# Altium schematic sheet WX0.012.296DL(3).SchDoc
size A3; PageSetup: Record=PageOptions|CenterHorizontal=True|CenterVertical=True|PrintScale=0.73|XCorrection=1.00|YCorrection=1.00|PrintKind=1|BorderSize=5000000|LeftOffset=0|BottomOffset=0|Orientation=2|PaperLength=1000|PaperWidth=1000|Scale=100|PaperSource=7|PrintQuality=-3|MediaType=1|DitherType=10|PrintScaleMode=1|PaperKind=A4 (210 x 297 毫米)|PaperIndex=9
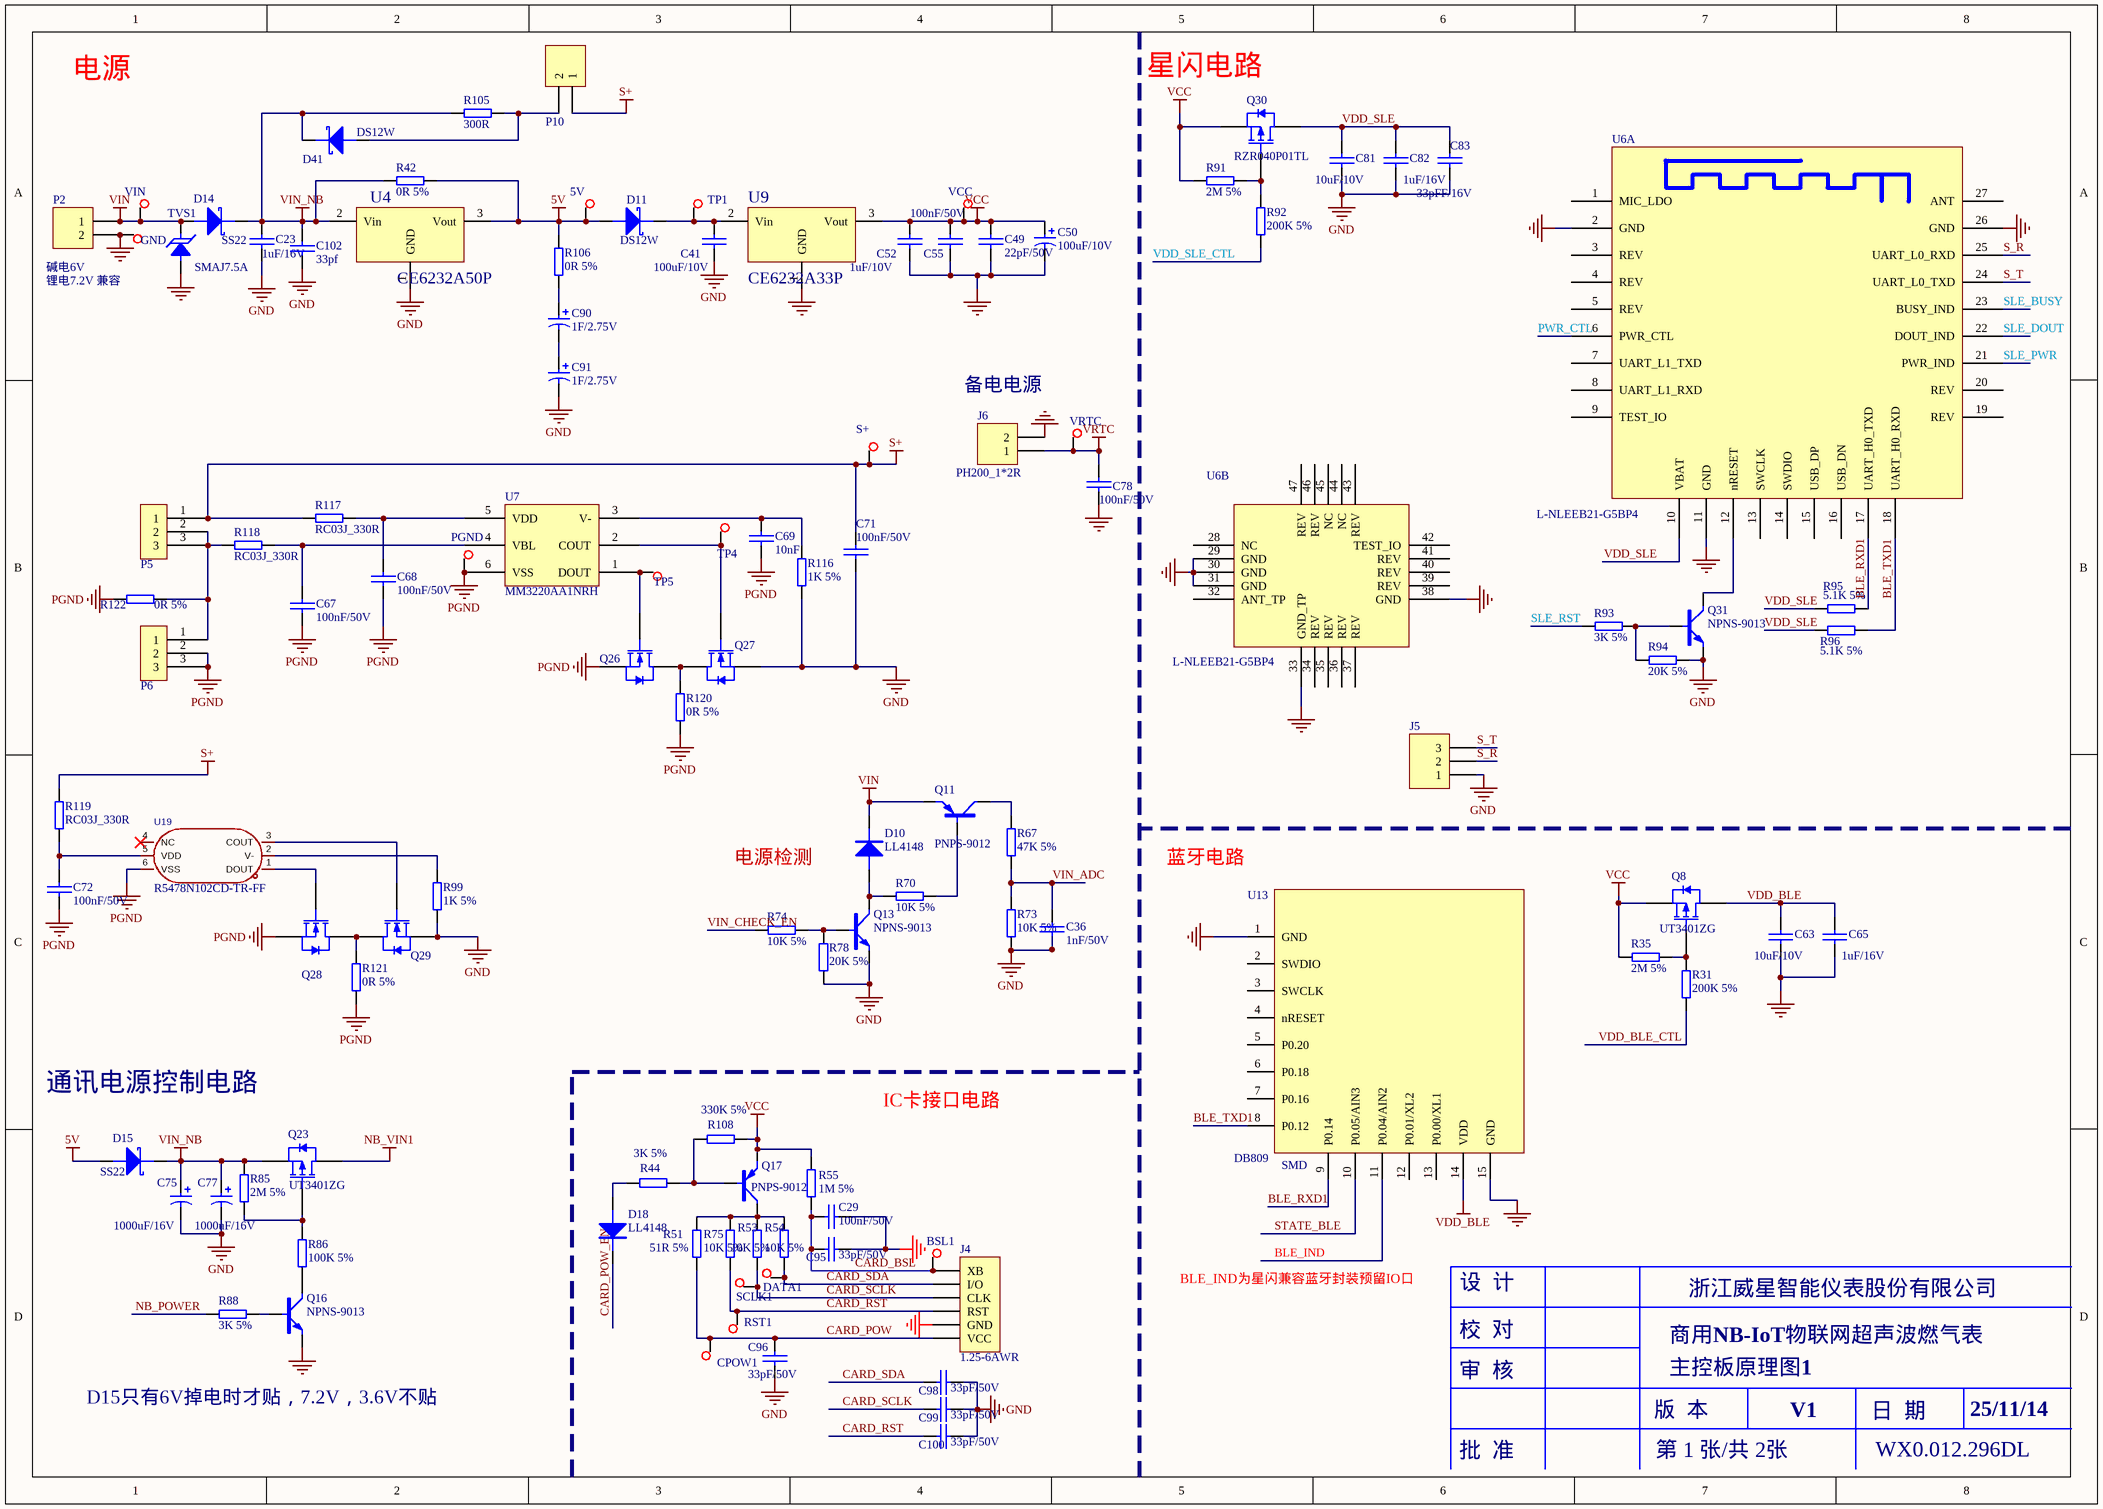
[diagram p0: WX0.012.296DL(3).SchDoc]

## Parts
5V  TEST-PAD  [TEST-PAD]  (value not drawn)
BSL1  TEST-PAD  [TEST-PAD]  (value not drawn)
C23  1uF/16V  [CAP0603]
C29  100nF/50V  [CAP0603]
C36  1nF/50V  [CAP0603]
C41  100uF/10V  [GRM31CR60J107ME39L]
C49  22pF/50V  [CAP0603]
C50  100uF/10V  [GRM31CR60J107ME39L]
C52  1uF/10V  [CAP0603]
C55  100nF/50V  [CAP0603]
C63  10uF/10V  [CAP0603]
C65  1uF/16V  [CAP0603]
C67  100nF/50V  [CAP0603]
C68  100nF/50V  [CAP0603]
C69  10nF  [CAP0603]
C71  100nF/50V  [CAP0603]
C72  100nF/50V  [CAP0603]
C75  1000uF/16V  [CAP-SMD_BD10.0-L10.3-W10.3-FD]
C77  1000uF/16V  [CAP-SMD_BD10.0-L10.3-W10.3-FD]
C78  100nF/50V  [CAP0603]
C81  10uF/10V  [CAP0603]
C82  1uF/16V  [CAP0603]
C83  33pFF/16V  [CAP0603]
C90  1F/2.75V  [CAPPC_350_800_1600]
C91  1F/2.75V  [CAPPC_350_800_1600]
C95  33pF/50V  [CAP0603]
C96  33pF/50V  [CAP0603]
C98  33pF/50V  [CAP0603]
C99  33pF/50V  [CAP0603]
C100  33pF/50V  [CAP0603]
C102  33pf  [CAP0603]
CPOW1  TEST-PAD  [TEST-PAD]  (value not drawn)
D10  LL4148  [SOD-123FL]
D11  DS12W  [SOD-123FL]
D14  SS22  [DO-214AC]
D15  SS22  [DO-214AC]
D18  LL4148  [SOD-123FL]
D41  DS12W  [SOD-123FL]
DATA1  TEST-PAD  [TEST-PAD]  (value not drawn)
GND  TEST-PAD  [TEST-PAD]  (value not drawn)
J4  1.25-6AWR  [SMT-1.25-6]
J5  PIN254_1*3  [PIN254_1*3*WXHJ]  (value not drawn)
J6  PH200_1*2R  [BAT]
P2  碱电6V  [Header 2]
P5  ER14250  [SPC1520_3]  (value not drawn)
P6  ER14250  [SPC1520_3]  (value not drawn)
P10  PH2.0-2P  [PCBComponent_1 - duplicate2]  (value not drawn)
PGND  TEST-PAD  [TEST-PAD]  (value not drawn)
Q8  UT3401ZG  [SOT-23]
Q11  PNPS-9012  [SOT-23]
Q13  NPNS-9013  [SOT-23]
Q16  NPNS-9013  [SOT-23]
Q17  PNPS-9012  [SOT-23]
Q23  UT3401ZG  [SOT-23]
Q26  RTR025N03TL  [SOT-23]  (value not drawn)
Q27  RTR025N03TL  [SOT-23]  (value not drawn)
Q28  RTR025N03TL  [SOT-23]  (value not drawn)
Q29  RTR025N03TL  [SOT-23]  (value not drawn)
Q30  RZR040P01TL  [SOT-23]
Q31  NPNS-9013  [SOT-23]
R31  200K 5%  [RES0603]
R35  2M 5%  [RES0603]
R42  0R 5%  [RES1206]
R44  3K 5%  [RES0603]
R51  51R 5%  [RES1206]
R53  10K 5%  [RES0603]
R54  10K 5%  [RES0603]
R55  1M 5%  [RES0603]
R67  47K 5%  [RES0603]
R70  10K 5%  [RES0603]
R73  10K 5%  [RES0603]
R74  10K 5%  [RES0603]
R75  10K 5%  [RES0603]
R78  20K 5%  [RES0603]
R85  2M 5%  [RES0603]
R86  100K 5%  [RES0603]
R88  3K 5%  [RES0603]
R91  2M 5%  [RES0603]
R92  200K 5%  [RES0603]
R93  3K 5%  [RES0603]
R94  20K 5%  [RES0603]
R95  5.1K 5%  [RES0603]
R96  5.1K 5%  [RES0603]
R99  1K 5%  [RES0603]
R105  300R  [RES1206]
R106  0R 5%  [RES0603]
R108  330K 5%  [RES0603]
R116  1K 5%  [RES0603]
R117  RC03J_330R  [RES1206]
R118  RC03J_330R  [RES1206]
R119  RC03J_330R  [RES1206]
R120  0R 5%  [RES0603]
R121  0R 5%  [RES0603]
R122  0R 5%  [RES0603]
RST1  TEST-PAD  [TEST-PAD]  (value not drawn)
S+  TEST-PAD  [TEST-PAD]  (value not drawn)
SCLK1  TEST-PAD  [TEST-PAD]  (value not drawn)
TP1  TEST-PAD  [TEST-PAD]  (value not drawn)
TP4  TEST-PAD  [TEST-PAD]  (value not drawn)
TP5  TEST-PAD  [TEST-PAD]  (value not drawn)
TVS1  SMAJ7.5A  [PCBComponent_1 - duplicate4]
U4  CE6232A50P  [SOT-89]
U6  L-NLEEB21-G5BP4  [L-NLEEB21-G5BP4]  (parts A,B of 2)
U7  MM3220AA1NRH  [SOT-23-6]
U9  CE6232A33P  [SOT-89]
U13  DB809  SMD/DIP: SMD  [DB809]
U19  R5478N102CD-TR-FF  [SOT-23-6_L2.9-W1.6-P0.95-LS2.8-BL]
VCC  TEST-PAD  [TEST-PAD]  (value not drawn)
VIN  TEST-PAD  [TEST-PAD]  (value not drawn)
VRTC  TEST-PAD  [TEST-PAD]  (value not drawn)

## Nets
5V: 5V.1 D11.1 D15.1 R42.2 R106.2 U4.3(Vout)
GND: C23.2 C29.1 C36.1 C41.2 C49.1 C50.2 C52.2 C55.1 C63.2 C65.2 C71.1 C75.2 C77.2 C78.2 C81.2 C82.2 C83.2 C91.2 C95.2 C96.1 C98.2 C99.2 C100.2 C102.2 GND.1 J4.5(GND) J5.1 J6.2 P2.2 Q13.2(E) Q16.2(E) Q27.2(S) Q29.2(S) Q31.2(E) R73.2 R78.2 R94.2 R99.1 R116.2 TVS1.1 U4.1(GND) U6.2(GND) U6.11(GND) U6.26(GND) U6.29(GND) U6.30(GND) U6.31(GND) U6.33(GND_TP) U6.38(GND) U9.1(GND) U13.1(GND) U13.15(GND)
NB_VIN1: Q23.3(D)
PGND: C67.1 C68.1 C69.2 C72.1 P6.2 P6.3 PGND.1 Q26.2(S) Q28.2(S) R120.1 R121.1 R122.1 U7.6(VSS) U19.6(VSS)
S+: C71.2 P5.1 P10.1 R117.1 R119.1 S+.1
VCC: C49.2 C50.1 C52.1 C55.2 Q8.2(S) Q17.2(E) Q30.2(S) R35.1 R55.2 R91.2 R108.2 U9.3(Vout) VCC.1
VDD_BLE: C63.1 C65.1 Q8.3(D) U13.14(VDD)
VIN: D10.2 D14.1 P2.1 Q11.2(E) TVS1.2 VIN.1
VIN_NB: C23.1 C75.1 C77.1 C102.1 D14.2 D15.2 D41.2 Q23.2(S) R42.1 R85.1 R105.1 U4.2(Vin)
VRTC: C78.1 J6.1 VRTC.1
BLE_IND: U13.11(P0.04/AIN2)
BLE_RXD1: R95.2 U6.17(UART_H0_TXD) U13.9(P0.14)
BLE_TXD1: R96.2 U6.18(UART_H0_RXD) U13.8(P0.12)
CARD_BSL: BSL1.1 C29.2 C95.1 J4.1(XB) R55.1
CARD_POW: C96.2 CPOW1.1 J4.6(VCC) R51.1
CARD_POW_EN: D18.2
CARD_RST: C100.1 J4.4(RST) R75.2 RST1.1
CARD_SCLK: C99.1 J4.3(CLK) R53.2 SCLK1.1
CARD_SDA: C98.1 DATA1.1 J4.2(I/O) R54.2
NB_POWER: R88.2
PWR_CTL: U6.6(PWR_CTL)
S_R: J5.2 U6.25(UART_L0_RXD)
S_T: J5.3 U6.24(UART_L0_TXD)
SLE_BUSY: U6.23(BUSY_IND)
SLE_DOUT: U6.22(DOUT_IND)
SLE_PWR: U6.21(PWR_IND)
SLE_RST: R93.1
STATE_BLE: U13.10(P0.05/AIN3)
VDD_BLE_CTL: R31.1
VDD_SLE: C81.1 C82.1 C83.1 Q30.3(D) R95.1 R96.1 U6.10(VBAT)
VDD_SLE_CTL: R92.1
VIN_ADC: C36.2 R67.2 R73.1
VIN_CHECK_EN: R74.1
NetC41_1: C41.1 D11.2 TP1.1 U9.2(Vin)
NetC67_2: C67.2 R118.2 U7.4(VBL)
NetC68_2: C68.2 R117.2 U7.5(VDD)
NetC69_1: C69.1 R116.1 U7.3(V-)
NetC72_2: C72.2 R119.2 U19.5(VDD)
NetC90_1: C90.1 R106.1
NetC90_2: C90.2 C91.1
NetD10_1: D10.1 Q13.3(C) R70.1
NetD18_1: D18.1 R44.1
NetD41_1: D41.1 P10.2 R105.2
NetP5_2: P5.2 P5.3 P6.1 R118.1 R122.2
NetQ8_1: Q8.1(G) R31.2 R35.2
NetQ11_1: Q11.1(B) R70.2
NetQ11_3: Q11.3(C) R67.1
NetQ13_1: Q13.1(B) R74.2 R78.1
NetQ16_1: Q16.1(B) R88.1
NetQ16_3: Q16.3(C) R86.1
NetQ17_1: Q17.1(B) R44.2 R108.1
NetQ17_3: Q17.3(C) R51.2 R53.1 R54.1 R75.1
NetQ23_1: Q23.1(G) R85.2 R86.2
NetQ26_1: Q26.1(G) TP5.1 U7.1(DOUT)
NetQ26_3: Q26.3(D) Q27.3(D) R120.2
NetQ27_1: Q27.1(G) TP4.1 U7.2(COUT)
NetQ28_1: Q28.1(G) U19.1(DOUT)
NetQ28_3: Q28.3(D) Q29.3(D) R121.2
NetQ29_1: Q29.1(G) U19.3(COUT)
NetQ30_1: Q30.1(G) R91.1 R92.2
NetQ31_1: Q31.1(B) R93.2 R94.1
NetQ31_3: Q31.3(C) U6.12(nRESET)
NetR99_2: R99.2 U19.2(V-)

Not connected (* = marked no-connect by the designer): U6 1(MIC_LDO) 3(REV) 4(REV) 5(REV) 7(UART_L1_TXD) 8(UART_L1_RXD) 9(TEST_IO) 13(SWCLK) 14(SWDIO) 15(USB_DP) 16(USB_DN) 19(REV) 20(REV) 27(ANT) 28(NC) 32(ANT_TP) 34(REV) 35(REV) 36(REV) 37(REV) 39(REV) 40(REV) 41(REV) 42(TEST_IO) 43(REV) 44(NC) 45(NC) 46(REV) 47(REV); U13 2(SWDIO) 3(SWCLK) 4(nRESET) 5(P0.20) 6(P0.18) 7(P0.16) 12(P0.01/XL2) 13(P0.00/XL1); U19 4(NC)*

## Notes on the sheet
- 电源
- 星闪电路
- 锂电7.2V 兼容
- (near J6) 备电电源
- 电源检测
- 蓝牙电路
- 通讯电源控制电路
- IC卡接口电路
- BLE_IND为星闪兼容蓝牙封装预留IO口
- 设  计
- 浙江威星智能仪表股份有限公司
- 审  核
- 校  对
- 商用NB-IoT物联网超声波燃气表
- 主控板原理图1
- D15只有6V掉电时才贴，7.2V，3.6V不贴
- 批  准
- 版  本
- 第 1 张/共 2张
- V1
- 日  期
- WX0.012.296DL
- 25/11/14

## Library data of the parts
5V BSL1 CPOW1 DATA1 GND PGND RST1 S+ SCLK1 TP1 TP4 TP5 VCC VIN VRTC = AD_WXHJ_TEST-PAD_01: 单面焊盘测试点; Part Name: 测试点; ID: 23; SMD/DIP: SMD; Part Number: AD_WXHJ_TEST-PAD_01
C23 C65 C82 C83 C102 = 101020103-0003: 105pF,16 V,±10%,0603,国巨,CC0603KRX7R7BB105; Part Name: 0603贴片电容; ID: 14; SMD/DIP: SMD; Part Number: 101020103-0003
C29 C67 C68 C71 C72 C78 = 101020103-0021: 104pF,50 V,±10%,0603,国巨,CC0603KRX7R9BB104; Part Name: 0603贴片电容; ID: 3; SMD/DIP: SMD; Part Number: 101020103-0021
C36 = 101020103-0022: 102pF,50 V,±10%,0603,国巨,CC0603KRX7R9BB102; Part Name: 0603贴片电容; ID: 14; SMD/DIP: SMD; Part Number: 101020103-0022
C41 C52 C63 C81 = 101020103-0026: 106pF,10 V,±10%,0603,村田,GRM188R61A106KE47D; Part Name: 0603贴片电容; ID: 8; SMD/DIP: SMD; Part Number: 101020103-0026
C49 = 101020103-0009: 22pF,50 V,±5%,0603,国巨,CC0603JRNPO9BN22; Part Name: 0603贴片电容; ID: 16; SMD/DIP: SMD; Part Number: 101020103-0009
C50 = 1010205-0006: 100UF,10 V,±20%,3528,AVX / KEMET,TAJB107M010RNJ; Part Name: 3528贴片钽电容; ID: 5; SMD/DIP: SMD; Part Number: 1010205-0006
C55 = 101020103-0021: 104pF,50 V,±10%,0603,国巨,CC0603KRX7R9BB104; Part Name: 0603贴片电容; ID: 12; SMD/DIP: SMD; Part Number: 101020103-0021
C69 = 101020103-0021: 103pF,50 V,±10%,0603,国巨,CC0603KRX7R9BB104; Part Name: 0603贴片电容; ID: 3; SMD/DIP: SMD
C75 C77 = 1010203-0029: 1000uF,16 V,±20%,8*20mm,Rubycon,16ZLH1000M; Part Name: 电解电容; ID: 2; SMD/DIP: DIP; Part Number: 1010203-0029
C90 C91 = 1010202-0015: 1F,2.75 V,-20%~+20%,8mm*16mm,红宝石,2.7 DMC 1 M MY4 8X16; Part Name: 法拉电容; ID: 12; SMD/DIP: DIP; Part Number: 1010202-0015
C95 C96 C98-C100 = 101020103-0027: 33pF,50 V,±10%,0603,国巨,CC0603KRNPO9BN33; Part Name: 0603贴片电容; ID: 18; SMD/DIP: SMD; Part Number: 101020103-0027
D10 D18 = 101040101-0005: 4148,4148,0.2 A,1 V,100 V,先科,LL4148; Part Name: 贴片二极管; Text Field1: 010101020002; Text Field2: 10; ID: 11; SMD/DIP: SMD; Part Number: 101040101-0005
D11 D41 = 101040101-0048: DS12W,SOD-123FL,1 A,0.55 V,20 V,领晨科技,DS12W; Part Name: 贴片肖特基; ID: 8; SMD/DIP: SMD; Part Number: 101040101-0048
D14 D15 = 101040101-0009: SS12,DO-214AC,1 A,0.55 V,20 V,昶鑫,SS12; Part Name: 贴片肖特基; ID: 14; SMD/DIP: SMD; Part Number: 101040101-0009
J4 = 1010902-0121: 1.25-6AWR 卷,6针1.25mm,母头,单排,贴片卧式; Part Name: 插座; ID: 32; SMD/DIP: SMD; Part Number: 1010902-0121
J6 P2 = 1010902-0105: 2.0-2AW,直插弯座，2PIN，脚间距2mm，带防翘起,公头,单排,2.0-2AW;直插弯座，2PIN,脚间距2mm，带防翘起; Part Name: PH座; ID: 11; SMD/DIP: DIP; Part Number: 1010902-0105
P5 P6 = 1011101-0203: F0005Q-LF,1200 mA*h,0,3.6 V,带连接片,1/2AA,不能充电,85 ℃,-60 ℃,ER14250,惠州亿纬锂能股份有限公司; Part Name: 锂电池; ID: 25; SMD/DIP: DIP; Part Number: 1011101-0203
P10 = 1010902-0117: PH2.0-2P,2mm间距,母头,单排,PH2.0-2P; Part Name: PH座; ID: 30; SMD/DIP: DIP; Part Number: 1010902-0117
Q8 = 101040201-0013: UT3401ZG,P-MOS,SOT-23,UTC,UT3401ZG; Part Name: 功率MOS管; ID: 18; SMD/DIP: SMD; Part Number: 101040201-0013
Q11 Q17 = 101040201-0001: 9012,PNP,SOT-23,JCET;长电,S9012; Part Name: 贴片三极管; ID: 17; SMD/DIP: SMD; Part Number: 101040201-0001
Q13 Q16 Q31 = 101040201-0002: 9013,NPN,SOT-23,长电,S9013; Part Name: 贴片三极管; ID: 15; SMD/DIP: SMD; Part Number: 101040201-0002
Q23 = 101040201-0013: UT3401ZG,P-MOS,SOT-23,UTC,UT3401ZG; Part Name: 功率MOS管; ID: 19; SMD/DIP: SMD; Part Number: 101040201-0013
Q26-Q29 = 101040201-0012: Part Name: NMOS管; ID: 16; SMD/DIP: SMD; Part Number: 101040201-0012
Q30 = 101040201-0010: RZR040P01TL；1.5v导通,P-MOS,SOT-23,罗姆,RZR040P01TL; Part Name: PMOS管; ID: 18; SMD/DIP: SMD; Part Number: 101040201-0010
R31 R35 = 101010103-0003: 10K±5%,1/10W,0603; Part Name: 0603贴片电阻; ID: 32; Part Number: 101010103-0003
R42 = 101010101-0013: 0Ω,±5%,1/4W,1206,国巨,RC1206JR-070RL; Part Name: 1206贴片电阻; ID: 2; SMD/DIP: SMD; Part Number: 101010101-0013
R44 R108 = 101010103-0006: 国巨,±5%,0603,,155 ℃,-55 ℃,RC0603JR-073KL,无铅,100 ppm/℃,1/10W,,3K; Part Name: 0603贴片电阻; ID: 22; SMD/DIP: SMD; Part Number: 101010103-0006
R51 = 101010101-0029: 51Ω,±5%,1/4W,1206,国巨,RC1206JR-0751RL; Part Name: 1206贴片电阻; ID: 28; SMD/DIP: SMD; Part Number: 101010101-0029
R53 R54 R70 R73-R75 = 101010103-0003: 国巨,±5%,0603,,155 ℃,-55 ℃,RC0603JR-0710KL,无铅,200 ppm/℃,1/10W,,10K; Part Name: 0603贴片电阻; ID: 7; SMD/DIP: SMD; Part Number: 101010103-0003
R55 = 101010103-0002: 国巨,±5%,0603,,155 ℃,-55 ℃,RC0603JR-071ML,无铅,200 ppm/℃,1/10W,,1M; Part Name: 0603贴片电阻; ID: 10; SMD/DIP: SMD; Part Number: 101010103-0002
R67 = 101010103-0012: 47K,±5%,1/10W,0603,国巨,RC0603JR-0747KL; Part Name: 0603贴片电阻; ID: 30; SMD/DIP: SMD; Part Number: 101010103-0012
R78 = 101010103-0004: 国巨,±5%,0603,,155 ℃,-55 ℃,RC0603JR-0720KL,无铅,200 ppm/℃,1/10W,,20K; Part Name: 0603贴片电阻; ID: 16; SMD/DIP: SMD; Part Number: 101010103-0004
R85 R91 = 101010103-0025: 国巨,±5%,0603,,155 ℃,-55 ℃,RC0603JR-072ML,含铅,100 ppm/℃,1/10W,,2M; Part Name: 0603贴片电阻; ID: 20; SMD/DIP: SMD; Part Number: 101010103-0025
R86 = 101010103-0005: 国巨,±5%,0603,,155 ℃,-55 ℃,RC0603JR-07100KL,无铅,100 ppm/℃,1/10W,,100K; Part Name: 0603贴片电阻; ID: 3; SMD/DIP: SMD; Part Number: 101010103-0005
R88 = 101010103-0006: 国巨,±5%,0603,,155 ℃,-55 ℃,RC0603JR-073KL,无铅,100 ppm/℃,1/10W,,3K; Part Name: 0603贴片电阻; ID: 27; SMD/DIP: SMD; Part Number: 101010103-0006
R92 = 101010103-0034: 200K,±5%,1/10W,0603,国巨,RC0603JR-07200KL; Part Name: 0603贴片电阻; ID: 13; SMD/DIP: SMD; Part Number: 101010103-0034
R93 = 101010103-0006: 国巨,±5%,0603,,155 ℃,-55 ℃,RC0603JR-073KL,无铅,100 ppm/℃,1/10W,,3K; Part Name: 0603贴片电阻; ID: 23; SMD/DIP: SMD; Part Number: 101010103-0006
R94 = 101010103-0004: 国巨,±5%,0603,,155 ℃,-55 ℃,RC0603JR-0720KL,无铅,200 ppm/℃,1/10W,,20K; Part Name: 0603贴片电阻; ID: 15; SMD/DIP: SMD; Part Number: 101010103-0004
R95 R96 = 101010103-0015: 国巨,±5%,0603,,155 ℃,55 ℃,RC0603JR-075.1KL,无铅,200 ppm/℃,1/10W,,5.1k; Part Name: 0603贴片电阻; ID: 27; SMD/DIP: SMD; Part Number: 101010103-0015
R99 R116 = 101010103-0008: 1K,±5%,1/10W,0603,国巨,RC0603JR-071KL; Part Name: 0603贴片电阻; ID: 10; SMD/DIP: SMD; Part Number: 101010103-0008
R105 = 101010103-0022: 100R,±5%,1/10W,0603,国巨,RC0603JR-07100RL; Part Name: 0603贴片电阻; ID: 5; SMD/DIP: SMD; Part Number: 101010103-0022
R106 R120-R122 = 101010103-0001: 国巨,±5%,0603,,155 ℃,-55 ℃,RC0603J2-070RL,无铅,200 ppm/℃,1/10W,,0R; Part Name: 0603贴片电阻; ID: 1; SMD/DIP: SMD; Part Number: 101010103-0001
TVS1 = 101040101-0024: SMBJ6.0CA,DO-214AA,10.3 V,6.0 V,600 W,58.3 A,800 uA,上海君耀电子有限公司,SMBJ6.0CA; Part Name: TVS管; ID: 23; SMD/DIP: SMD; Part Number: 101040101-0024
U4 = 1010503-0028: CE6232A50P,CE6232A50P,SOT89-3,8 V,1.8 V,0.11 V,5 V,500mA,0.8 uA,南京芯力微电子有限公司; Part Name: 贴片稳压器; ID: 6; SMD/DIP: SMD; Part Number: 1010503-0028
U9 = 1010503-0029: CE6232-3.3,CE6232-3.3,SOT89-3,8V,1.8V,0.11V,3.3V,300mA,0.8uA,南京芯力微电子有限公司; Part Name: 线性稳压芯片; ID: 5; SMD/DIP: SMD; Part Number: 1010503-0029
U13 = 1011402-0194: 北高智蓝牙模块DB809; Part Name: 蓝牙模块; ID: 15; Part Number: 1011402-0194
U19 = R5478N102CD-TR-FF: Symbol: R5478N102CD-TR-FF